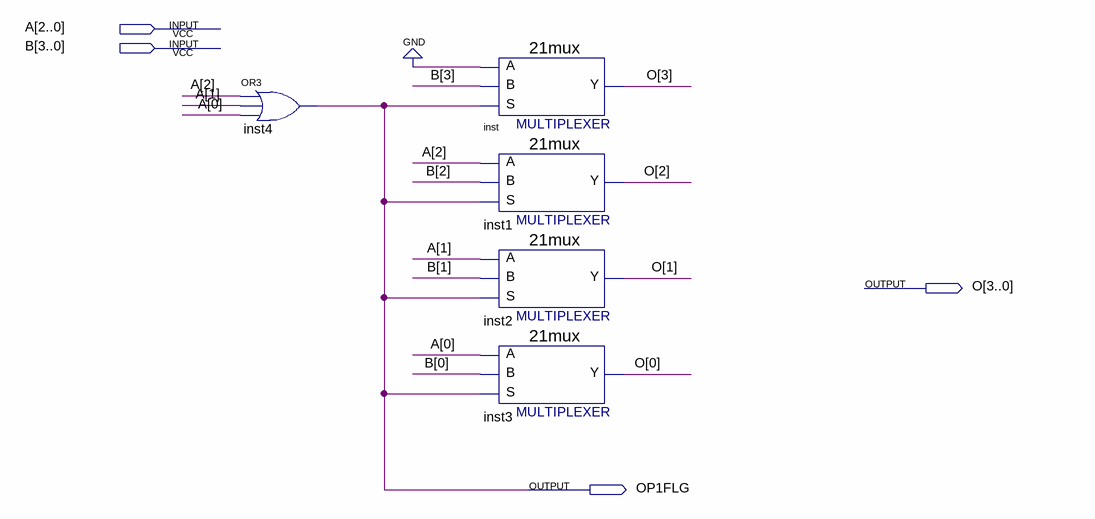
[diagram p0: schematic sheet]
// Quartus schematic Function.bdf as structural Verilog: 5 symbols, 4 pins
module Function (
  input  [2:0] A,
  input  [3:0] B,
  output [3:0] O,
  output OP1FLG
);

  or inst4 (OP1FLG, A[2], A[1], A[0]);
  \21mux  inst (.S(OP1FLG), .B(B[3]), .A(1'b0), .Y(O[3]));
  \21mux  inst1 (.S(OP1FLG), .B(B[2]), .A(A[2]), .Y(O[2]));
  \21mux  inst2 (.S(OP1FLG), .B(B[1]), .A(A[1]), .Y(O[1]));
  \21mux  inst3 (.S(OP1FLG), .B(B[0]), .A(A[0]), .Y(O[0]));
endmodule
